# Altium schematic sheet CameraBoard.SchDoc
size A4; SheetNumber: 1; SheetTotal: 5
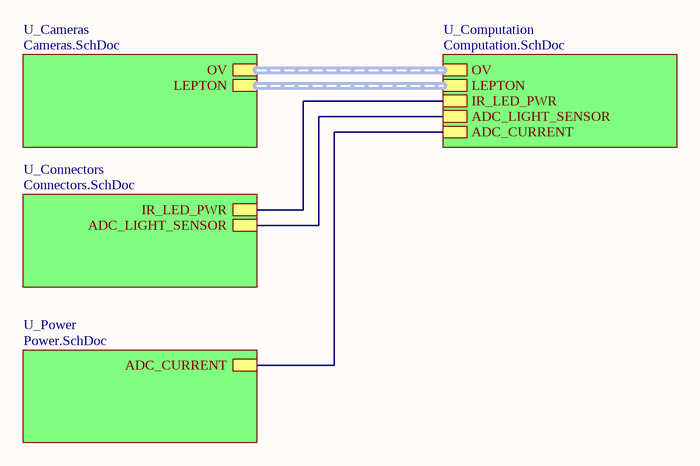
[diagram p0: CameraBoard.SchDoc]

## Sub-sheets
U_Cameras = Cameras.SchDoc: OV (harness OV), LEPTON (harness LEPTON)
U_Computation = Computation.SchDoc: OV (harness OV), LEPTON (harness LEPTON), IR_LED_PWR, ADC_LIGHT_SENSOR, ADC_CURRENT
U_Connectors = Connectors.SchDoc: IR_LED_PWR, ADC_LIGHT_SENSOR
U_Power = Power.SchDoc: ADC_CURRENT

## Nets
(unnamed): sheet U_Computation/IR_LED_PWR, sheet U_Connectors/IR_LED_PWR
(unnamed): sheet U_Computation/ADC_LIGHT_SENSOR, sheet U_Connectors/ADC_LIGHT_SENSOR
(unnamed): sheet U_Computation/ADC_CURRENT, sheet U_Power/ADC_CURRENT

## Buses and harness runs
harness sheet U_Cameras/LEPTON = sheet U_Computation/LEPTON
harness sheet U_Cameras/OV = sheet U_Computation/OV